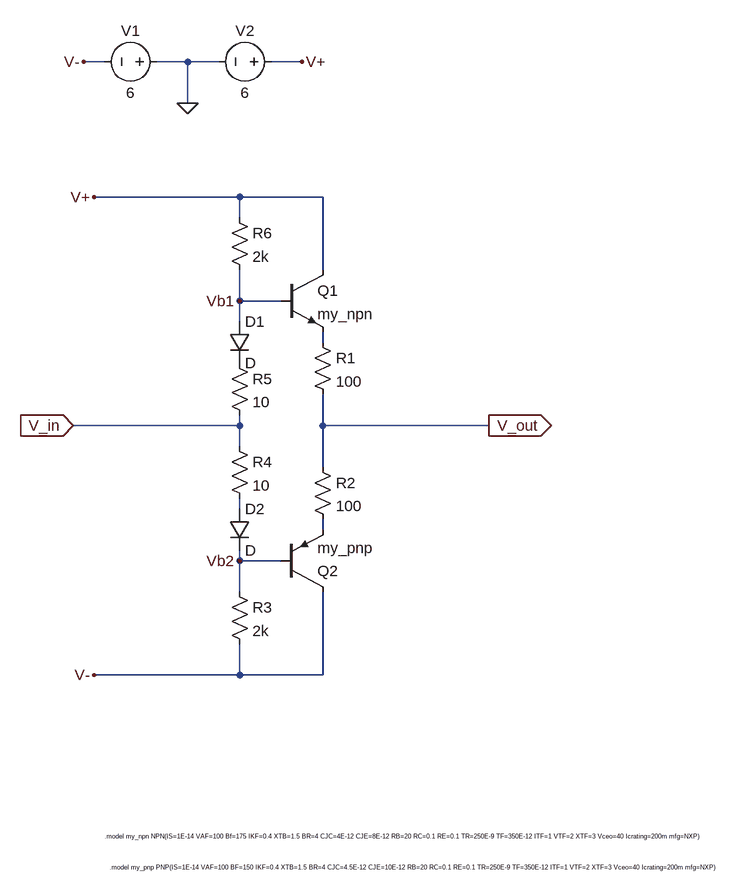
[diagram p0: schematic output_stage.asc]
output_stage.asc, the LTspice schematic file:
Version 4
SHEET 1 2800 768
WIRE -176 -480 -208 -480
WIRE -48 -480 -96 -480
WIRE 0 -480 -48 -480
WIRE 128 -480 80 -480
WIRE -48 -416 -48 -480
WIRE 32 -272 -192 -272
WIRE 160 -272 32 -272
WIRE 32 -240 32 -272
WIRE 160 -160 160 -272
WIRE 32 -112 32 -160
WIRE 96 -112 32 -112
WIRE 32 -80 32 -112
WIRE 160 -48 160 -64
WIRE 32 80 32 64
WIRE 32 80 -224 80
WIRE 160 80 160 32
WIRE 416 80 160 80
WIRE 32 112 32 80
WIRE 160 144 160 80
WIRE 32 208 32 192
WIRE 160 240 160 224
WIRE 32 288 32 272
WIRE 96 288 32 288
WIRE 32 336 32 288
WIRE 32 464 32 416
WIRE 32 464 -192 464
WIRE 160 464 160 336
WIRE 160 464 32 464
FLAG 128 -480 V+
FLAG -208 -480 V-
FLAG -48 -416 0
FLAG -192 -272 V+
FLAG -192 464 V-
FLAG 416 80 V_out
IOPIN 416 80 Out
FLAG 32 -112 Vb1
FLAG 32 288 Vb2
FLAG -224 80 V_in
IOPIN -224 80 In
SYMBOL npn 96 -160 R0
SYMATTR InstName Q1
SYMATTR Value my_npn
SYMBOL pnp 96 336 M180
SYMATTR InstName Q2
SYMATTR Value my_pnp
SYMBOL Res 144 -64 R0
SYMATTR InstName R1
SYMATTR Value 100
SYMBOL Res 144 128 R0
SYMATTR InstName R2
SYMATTR Value 100
SYMBOL Res 16 320 R0
SYMATTR InstName R3
SYMATTR Value 2k
SYMBOL Res 16 96 R0
SYMATTR InstName R4
SYMATTR Value 10
SYMBOL Res 16 -32 R0
SYMATTR InstName R5
SYMATTR Value 10
SYMBOL Res 16 -256 R0
SYMATTR InstName R6
SYMATTR Value 2k
SYMBOL Voltage -80 -480 R90
WINDOW 0 -32 56 VBottom 2
WINDOW 3 32 56 VTop 2
SYMATTR InstName V1
SYMATTR Value 6
SYMBOL Voltage 96 -480 R90
WINDOW 0 -32 56 VBottom 2
WINDOW 3 32 56 VTop 2
SYMATTR InstName V2
SYMATTR Value 6
SYMBOL Diode 16 -80 R0
SYMATTR InstName D1
SYMBOL Diode 16 208 R0
SYMATTR InstName D2
TEXT -176 712 Left 0 !.model my_npn NPN(IS=1E-14 VAF=100 Bf=175 IKF=0.4 XTB=1.5 BR=4 CJC=4E-12 CJE=8E-12 RB=20 RC=0.1 RE=0.1 TR=250E-9 TF=350E-12 ITF=1 VTF=2 XTF=3 Vceo=40 Icrating=200m mfg=NXP)
TEXT -168 760 Left 0 !.model my_pnp PNP(IS=1E-14 VAF=100 BF=150 IKF=0.4 XTB=1.5 BR=4 CJC=4.5E-12 CJE=10E-12 RB=20 RC=0.1 RE=0.1 TR=250E-9 TF=350E-12 ITF=1 VTF=2 XTF=3 Vceo=40 Icrating=200m mfg=NXP)

The netlist it stands for:
* output_stage.asc
Q1 V+ Vb1 N001 0 my_npn
Q2 V- Vb2 N003 0 my_pnp
R1 N001 V_out 100
R2 V_out N003 100
R3 Vb2 V- 2k
R4 V_in N002 10
R5 P001 V_in 10
R6 V+ Vb1 2k
V1 0 V- 6
V2 V+ 0 6
D1 Vb1 P001 D
D2 N002 Vb2 D
.model D D
.lib standard.dio
.model NPN NPN
.model PNP PNP
.lib standard.bjt
.model my_npn NPN(IS=1E-14 VAF=100 Bf=175 IKF=0.4 XTB=1.5 BR=4 CJC=4E-12 CJE=8E-12 RB=20 RC=0.1 RE=0.1 TR=250E-9 TF=350E-12 ITF=1 VTF=2 XTF=3 Vceo=40 Icrating=200m mfg=NXP)
.model my_pnp PNP(IS=1E-14 VAF=100 BF=150 IKF=0.4 XTB=1.5 BR=4 CJC=4.5E-12 CJE=10E-12 RB=20 RC=0.1 RE=0.1 TR=250E-9 TF=350E-12 ITF=1 VTF=2 XTF=3 Vceo=40 Icrating=200m mfg=NXP)
.backanno
.end